# Altium schematic sheet output_assignement.SchDoc
size A4; CompanyName: Technische Hochschule Nürnberg Georg Simon Ohm; Organization: UltraZohm; Address1: Kesslerplatz 12; Address2: 90489 Nürnberg; Address3: GERMANY; Website: www.ultrazohm.com
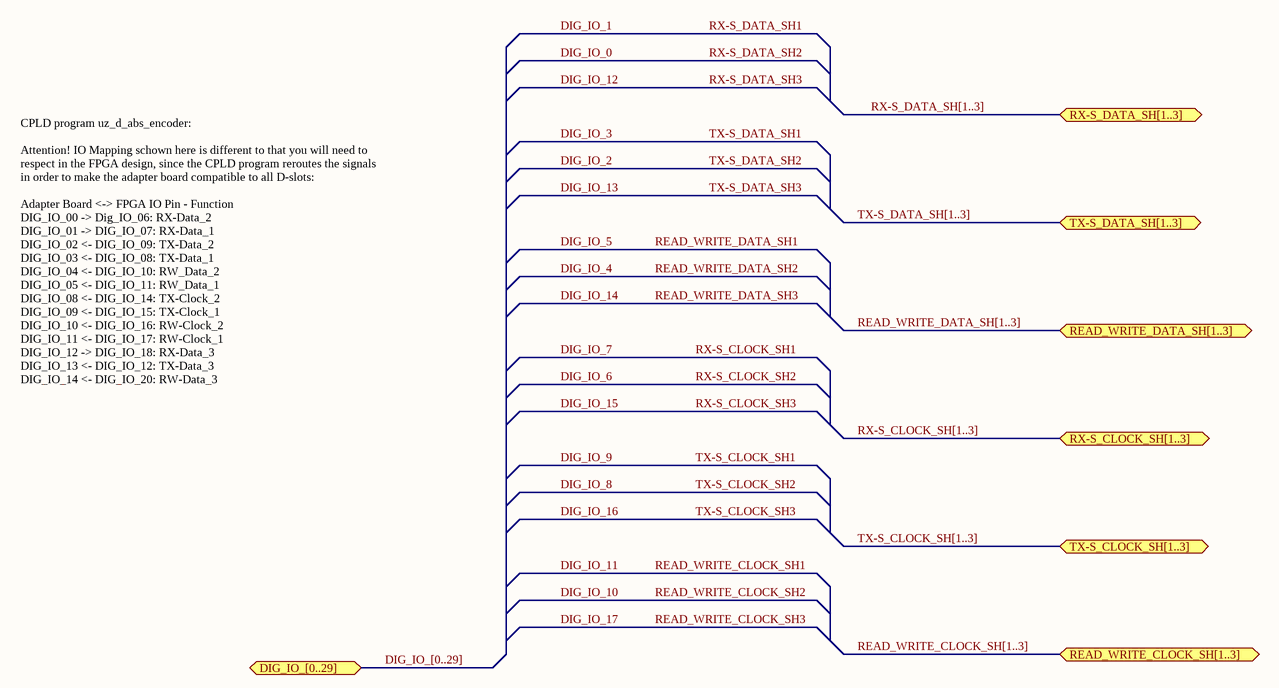
[diagram p0: output_assignement.SchDoc]

## Ports
DIG_IO_[0..29] (bidir), READ_WRITE_CLOCK_SH[1..3] (bidir), READ_WRITE_DATA_SH[1..3] (bidir), RX-S_CLOCK_SH[1..3] (bidir), RX-S_DATA_SH[1..3] (bidir), TX-S_CLOCK_SH[1..3] (bidir), TX-S_DATA_SH[1..3] (bidir)

## Buses and harness runs
bus DIG_IO_[0..29] = port DIG_IO_[0..29]
bus READ_WRITE_CLOCK_SH[1..3] = port READ_WRITE_CLOCK_SH[1..3]
bus READ_WRITE_DATA_SH[1..3] = port READ_WRITE_DATA_SH[1..3]
bus RX-S_CLOCK_SH[1..3] = port RX-S_CLOCK_SH[1..3]
bus RX-S_DATA_SH[1..3] = port RX-S_DATA_SH[1..3]
bus TX-S_CLOCK_SH[1..3] = port TX-S_CLOCK_SH[1..3]
bus TX-S_DATA_SH[1..3] = port TX-S_DATA_SH[1..3]

## Notes on the sheet
- CPLD program uz_d_abs_encoder:
  Attention! IO Mapping schown here is different to that you will need to respect in the FPGA design, since the CPLD program reroutes the signals in order to make the adapter board compatible to all D-slots:
  Adapter Board <-> FPGA IO Pin - Function
  DIG_IO_00 -> Dig_IO_06: RX-Data_2
  DIG_IO_01 -> DIG_IO_07: RX-Data_1
  DIG_IO_02 <- DIG_IO_09: TX-Data_2
  DIG_IO_03 <- DIG_IO_08: TX-Data_1
  DIG_IO_04 <- DIG_IO_10: RW_Data_2
  DIG_IO_05 <- DIG_IO_11: RW_Data_1
  DIG_IO_08 <- DIG_IO_14: TX-Clock_2
  DIG_IO_09 <- DIG_IO_15: TX-Clock_1
  DIG_IO_10 <- DIG_IO_16: RW-Clock_2
  DIG_IO_11 <- DIG_IO_17: RW-Clock_1
  DIG_IO_12 -> DIG_IO_18: RX-Data_3
  DIG_IO_13 <- DIG_IO_12: TX-Data_3
  DIG_IO_14 <- DIG_IO_20: RW-Data_3
  DIG_IO_16 <- DIG_IO_22: TX-Clock_3
  DIG_IO_17 <- DIG_IO_23: RW-Clock_3
- Title
- Revision:
- Design Engineer:
- Date:
- Project:
- Sheet
- of